# Altium schematic sheet Current_Sensing.SchDoc
size 381 x 241 mm; SheetNumber: 3; SheetTotal: 8
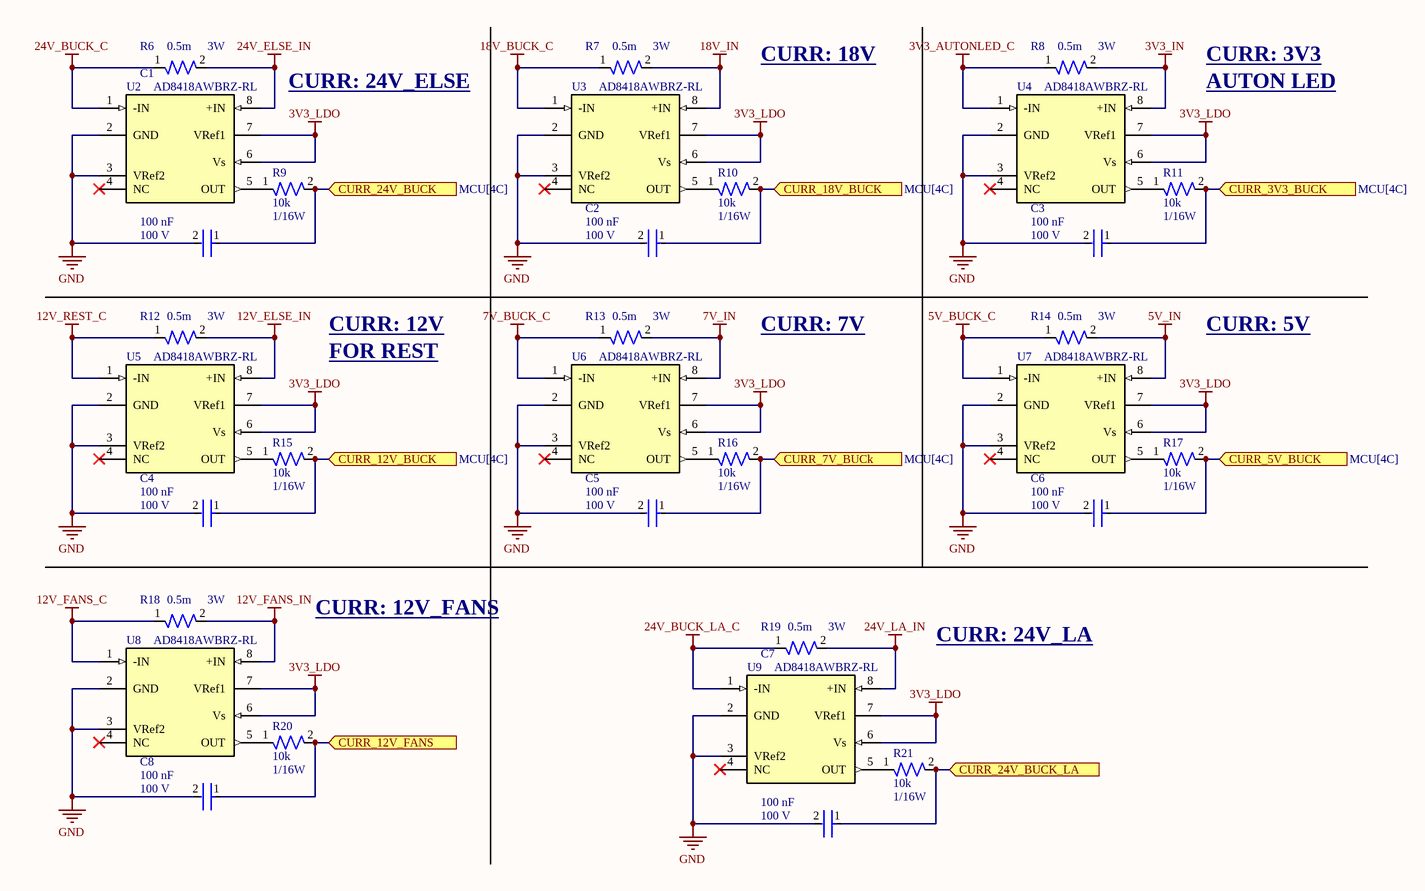
[diagram p0: Current_Sensing.SchDoc]

## Parts
C1  Capacitance: 100 nF  Voltage: 100 V  [CAP-0603]  (hidden comment: CC0603KRX7R0BB104)
C2  Capacitance: 100 nF  Voltage: 100 V  [CAP-0603]  (hidden comment: CC0603KRX7R0BB104)
C3  Capacitance: 100 nF  Voltage: 100 V  [CAP-0603]  (hidden comment: CC0603KRX7R0BB104)
C4  Capacitance: 100 nF  Voltage: 100 V  [CAP-0603]  (hidden comment: CC0603KRX7R0BB104)
C5  Capacitance: 100 nF  Voltage: 100 V  [CAP-0603]  (hidden comment: CC0603KRX7R0BB104)
C6  Capacitance: 100 nF  Voltage: 100 V  [CAP-0603]  (hidden comment: CC0603KRX7R0BB104)
C7  Capacitance: 100 nF  Voltage: 100 V  [CAP-0603]  (hidden comment: CC0603KRX7R0BB104)
C8  Capacitance: 100 nF  Voltage: 100 V  [CAP-0603]  (hidden comment: CC0603KRX7R0BB104)
R6  Power: 3W  Resistance: 0.5m  [RES-2512]  (hidden comment: CSNL2512FTL500)
R7  Power: 3W  Resistance: 0.5m  [RES-2512]  (hidden comment: CSNL2512FTL500)
R8  Power: 3W  Resistance: 0.5m  [RES-2512]  (hidden comment: CSNL2512FTL500)
R9  Resistance: 10k  Power: 1/16W  [RES-0402]  (hidden comment: RC0402FR-0710KL)
R10  Resistance: 10k  Power: 1/16W  [RES-0402]  (hidden comment: RC0402FR-0710KL)
R11  Resistance: 10k  Power: 1/16W  [RES-0402]  (hidden comment: RC0402FR-0710KL)
R12  Power: 3W  Resistance: 0.5m  [RES-2512]  (hidden comment: CSNL2512FTL500)
R13  Power: 3W  Resistance: 0.5m  [RES-2512]  (hidden comment: CSNL2512FTL500)
R14  Power: 3W  Resistance: 0.5m  [RES-2512]  (hidden comment: CSNL2512FTL500)
R15  Resistance: 10k  Power: 1/16W  [RES-0402]  (hidden comment: RC0402FR-0710KL)
R16  Resistance: 10k  Power: 1/16W  [RES-0402]  (hidden comment: RC0402FR-0710KL)
R17  Resistance: 10k  Power: 1/16W  [RES-0402]  (hidden comment: RC0402FR-0710KL)
R18  Power: 3W  Resistance: 0.5m  [RES-2512]  (hidden comment: CSNL2512FTL500)
R19  Power: 3W  Resistance: 0.5m  [RES-2512]  (hidden comment: CSNL2512FTL500)
R20  Resistance: 10k  Power: 1/16W  [RES-0402]  (hidden comment: RC0402FR-0710KL)
R21  Resistance: 10k  Power: 1/16W  [RES-0402]  (hidden comment: RC0402FR-0710KL)
U2  AD8418AWBRZ-RL  [IC-CURR]
U3  AD8418AWBRZ-RL  [IC-CURR]
U4  AD8418AWBRZ-RL  [IC-CURR]
U5  AD8418AWBRZ-RL  [IC-CURR]
U6  AD8418AWBRZ-RL  [IC-CURR]
U7  AD8418AWBRZ-RL  [IC-CURR]
U8  AD8418AWBRZ-RL  [IC-CURR]
U9  AD8418AWBRZ-RL  [IC-CURR]

## Ports
CURR_3V3_BUCK (in, see MCU[4C]), CURR_5V_BUCK (in, see MCU[4C]), CURR_7V_BUCk (in, see MCU[4C]), CURR_12V_BUCK (in, see MCU[4C]), CURR_12V_FANS (in), CURR_18V_BUCK (in, see MCU[4C]), CURR_24V_BUCK (in, see MCU[4C]), CURR_24V_BUCK_LA (in)

## Nets
3V3_AUTONLED_C: R8.1 U4.1(-IN)
3V3_IN: R8.2 U4.8(+IN)
3V3_LDO: U2.6(Vs) U2.7(VRef1) U3.6(Vs) U3.7(VRef1) U4.6(Vs) U4.7(VRef1) U5.6(Vs) U5.7(VRef1) U6.6(Vs) U6.7(VRef1) U7.6(Vs) U7.7(VRef1) U8.6(Vs) U8.7(VRef1) U9.6(Vs) U9.7(VRef1)
5V_BUCK_C: R14.1 U7.1(-IN)
5V_IN: R14.2 U7.8(+IN)
7V_BUCK_C: R13.1 U6.1(-IN)
7V_IN: R13.2 U6.8(+IN)
12V_ELSE_IN: R12.2 U5.8(+IN)
12V_FANS_C: R18.1 U8.1(-IN)
12V_FANS_IN: R18.2 U8.8(+IN)
12V_REST_C: R12.1 U5.1(-IN)
18V_BUCK_C: R7.1 U3.1(-IN)
18V_IN: R7.2 U3.8(+IN)
24V_BUCK_C: R6.1 U2.1(-IN)
24V_BUCK_LA_C: R19.1 U9.1(-IN)
24V_ELSE_IN: R6.2 U2.8(+IN)
24V_LA_IN: R19.2 U9.8(+IN)
GND: C1.2 C2.2 C3.2 C4.2 C5.2 C6.2 C7.2 C8.2 U2.2(GND) U2.3(VRef2) U3.2(GND) U3.3(VRef2) U4.2(GND) U4.3(VRef2) U5.2(GND) U5.3(VRef2) U6.2(GND) U6.3(VRef2) U7.2(GND) U7.3(VRef2) U8.2(GND) U8.3(VRef2) U9.2(GND) U9.3(VRef2)
CURR_3V3_BUCK: C3.1 R11.2 ; port CURR_3V3_BUCK
CURR_5V_BUCK: C6.1 R17.2 ; port CURR_5V_BUCK
CURR_7V_BUCk: C5.1 R16.2 ; port CURR_7V_BUCk
CURR_12V_BUCK: C4.1 R15.2 ; port CURR_12V_BUCK
CURR_12V_FANS: C8.1 R20.2 ; port CURR_12V_FANS
CURR_18V_BUCK: C2.1 R10.2 ; port CURR_18V_BUCK
CURR_24V_BUCK: C1.1 R9.2 ; port CURR_24V_BUCK
CURR_24V_BUCK_LA: C7.1 R21.2 ; port CURR_24V_BUCK_LA
NetR9_1: R9.1 U2.5(OUT)
NetR10_1: R10.1 U3.5(OUT)
NetR11_1: R11.1 U4.5(OUT)
NetR15_1: R15.1 U5.5(OUT)
NetR16_1: R16.1 U6.5(OUT)
NetR17_1: R17.1 U7.5(OUT)
NetR20_1: R20.1 U8.5(OUT)
NetR21_1: R21.1 U9.5(OUT)

Not connected (* = marked no-connect by the designer): U2 4(NC)*; U3 4(NC)*; U4 4(NC)*; U5 4(NC)*; U6 4(NC)*; U7 4(NC)*; U8 4(NC)*; U9 4(NC)*

## Notes on the sheet
- CURR: 24V_ELSE
- CURR: 18V
- CURR: 3V3
- AUTON LED
- CURR: 12V
- FOR REST
- CURR: 7V
- CURR: 5V
- CURR: 12V_FANS
- CURR: 24V_LA

## Library data of the parts
C1-C8 = CAP-100N-0001: CAP CER 0.1UF 100V X7R 0603; Device Class: Ceramic; Size: 0603; ComponentLink1Description: Datasheet; ComponentLink1URL: https://www.yageo.com/upload/media/product/app/datasheet/mlcc/upy-np0x7r_mv_100-to-630v.pdf
R6-R8 R12-R14 R18 R19 = RES-0.5m-0001: 2512 Chip Resistor - Surface Mount ROHS; Tolerance: 1%; Size: 0402; ComponentLink1Description: Datasheet; ComponentLink1URL: https://www.yageo.com/upload/media/product/products/datasheet/rchip/PYu-RC_Group_51_RoHS_L_12.pdf
R9-R11 R15-R17 R20 R21 = RES-10k-0001: RES 10K OHM 1% 1/16W 0402; Tolerance: 1%; Size: 0402; ComponentLink1Description: Datasheet; ComponentLink1URL: https://www.yageo.com/upload/media/product/products/datasheet/rchip/PYu-RC_Group_51_RoHS_L_12.pdf
U2-U9 = IC-CURR-0001: Current Sense Amplifier 1 Circuit 8-MSOP